# Altium project MagControl.PrjPCB (part 2 of 2)

## Sheet SCH_MagControl_Sheet2.SchDoc
size 431 x 279 mm; Revision: -; SheetNumber: 2; SheetTotal: 2; PageSetup: Record=PageOptions|CenterHorizontal=True|CenterVertical=True|PrintScale=0.98|XCorrection=1.00|YCorrection=1.00|PrintKind=1|BorderSize=5000000|LeftOffset=0|BottomOffset=0|Orientation=2|PaperLength=1000|PaperWidth=1000|Scale=100|PaperSource=15|PrintQuality=600|MediaType=1|DitherType=10|PaperKind=11 x 17|PrintScaleMode=1
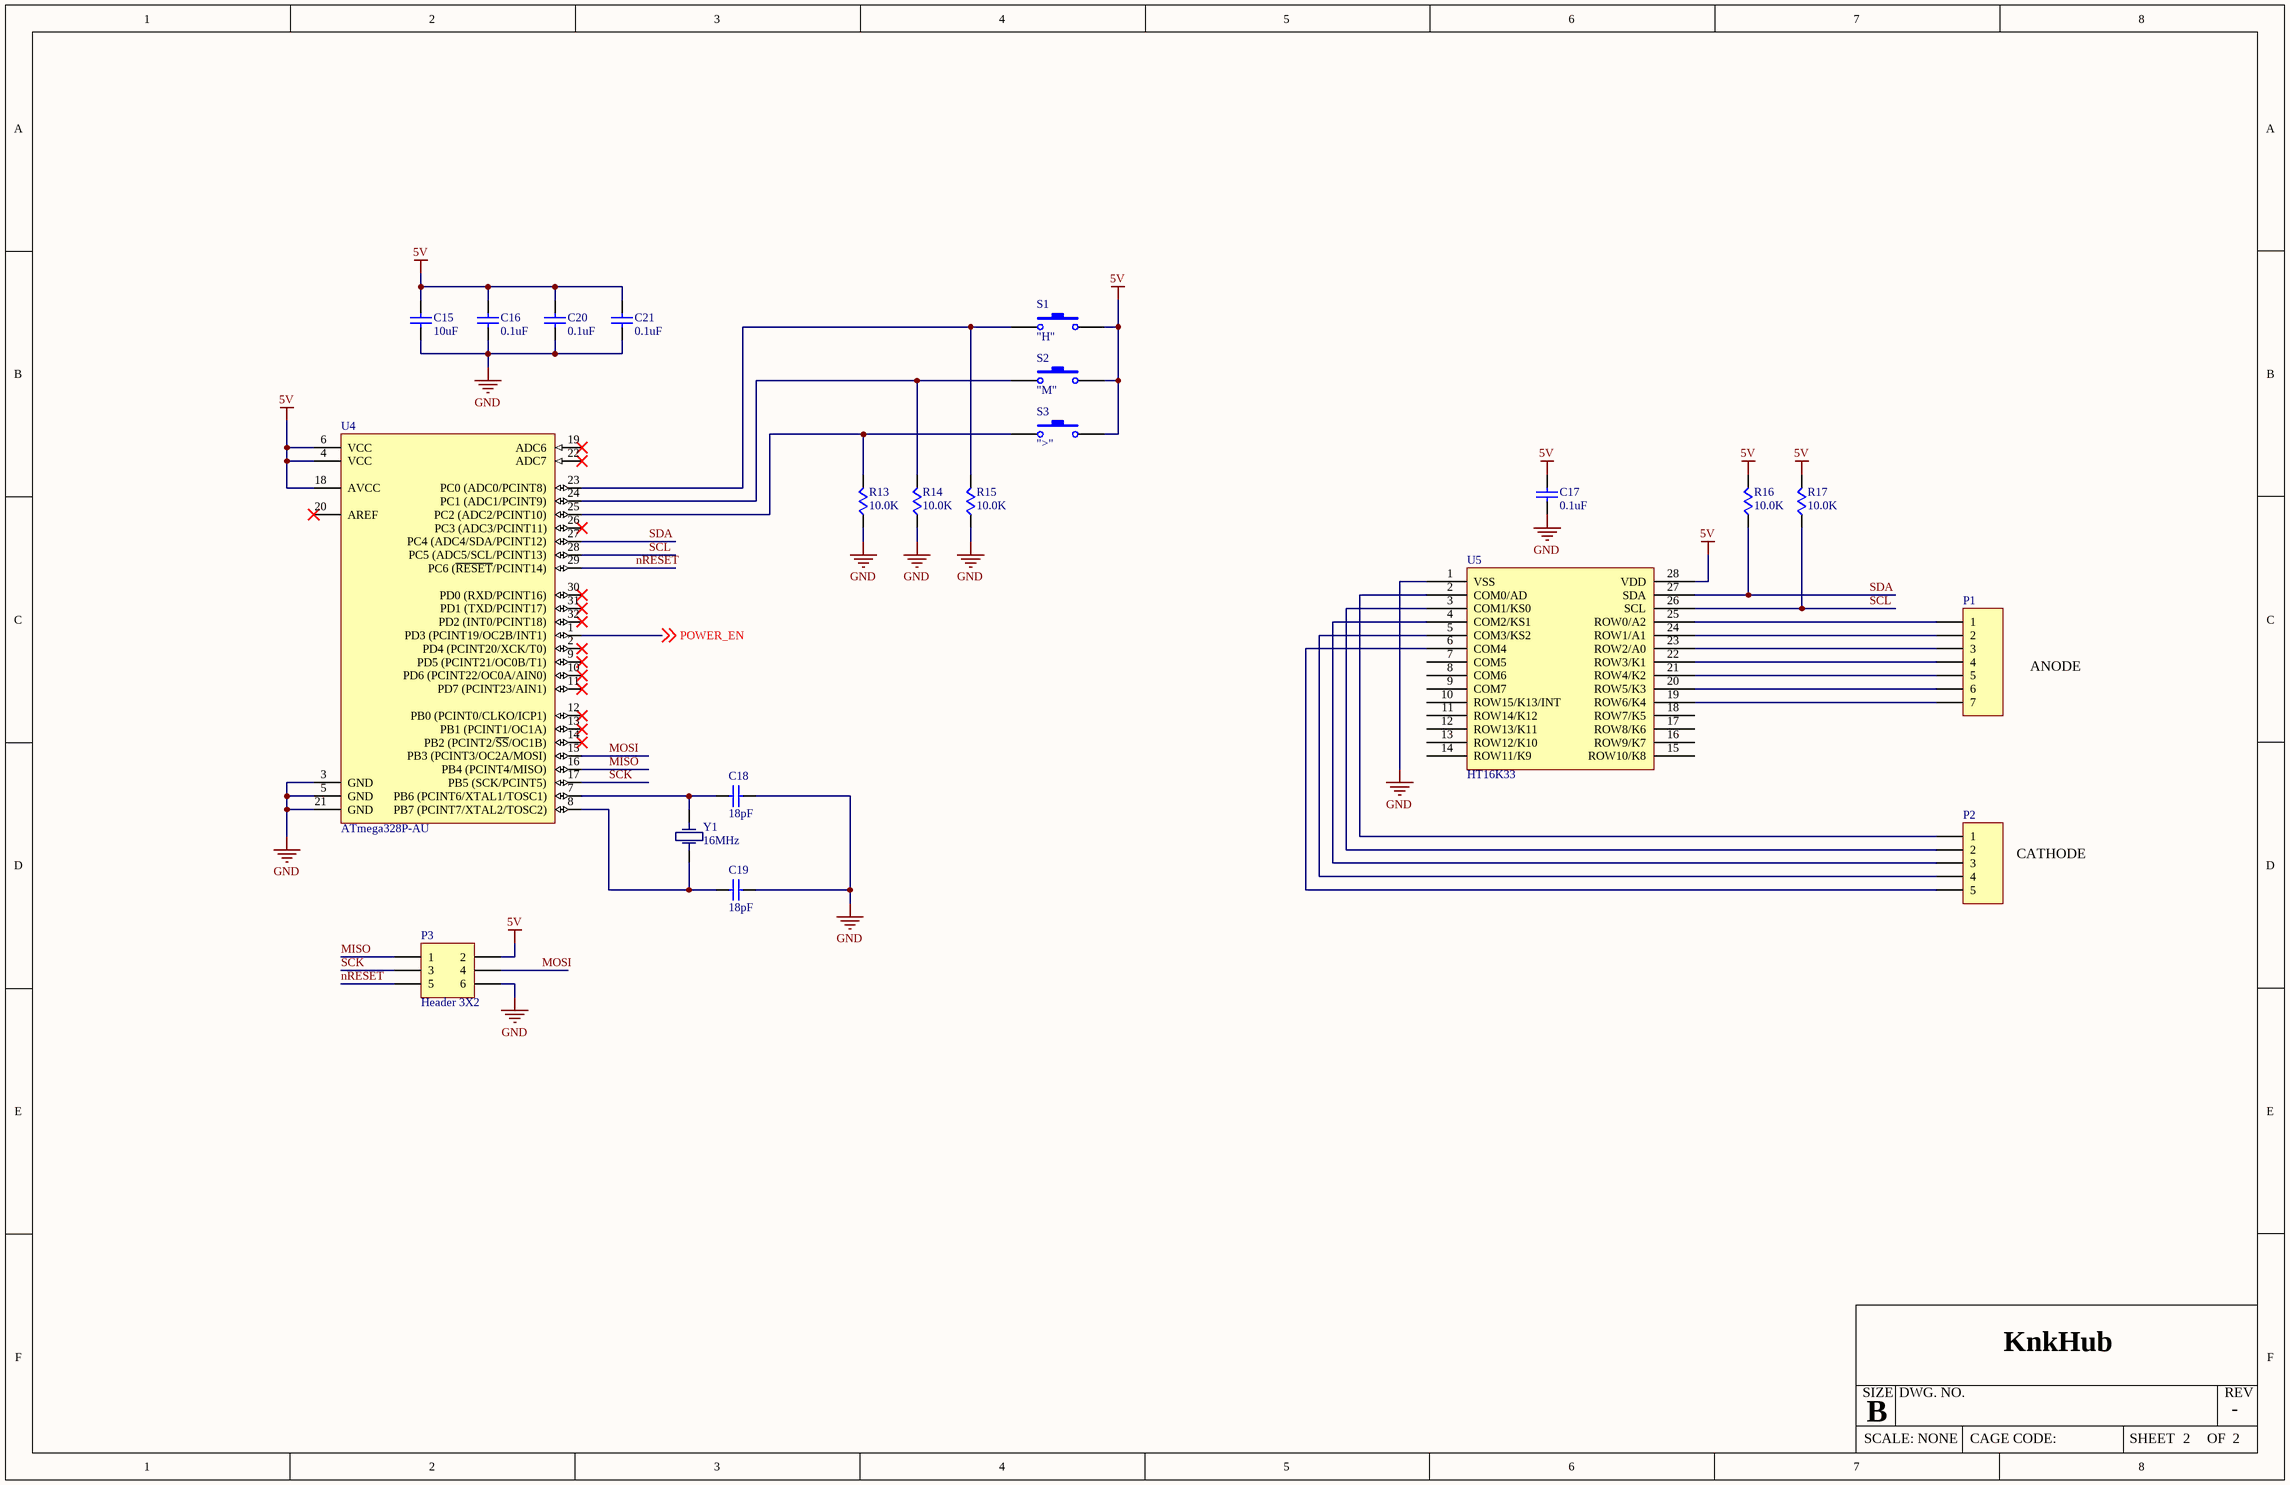
[diagram p1: SCH_MagControl_Sheet2.SchDoc]

### Parts
C15  value 10uF  [CAPC1608L]
C16  value 0.1uF  [CAPC1005L]
C17  value 0.1uF  [CAPC1005L]
C18  value 18pF  [CAPC1005L]
C19  value 18pF  [CAPC1005L]
C20  value 0.1uF  [CAPC1005L]
C21  value 0.1uF  [CAPC1005L]
P1  (no value)  [HDR1X7]
P2  (no value)  [HDR1X5]
P3  value Header 3X2  [HDR2X3]
R13  value 10.0K  [RESC1005N]
R14  value 10.0K  [RESC1005N]
R15  value 10.0K  [RESC1005N]
R16  value 10.0K  [RESC1005N]
R17  value 10.0K  [RESC1005N]
S1  "H"  [SPST-2]
S2  "M"  [SPST-2]
S3  ">"  [SPST-2]
U4  value ATmega328P-AU  [32A_L]
U5  value HT16K33  [SOP127P1030X264-28N]
Y1  value 16MHz  [CSM-3X]

### Nets
5V: C15.2 C16.2 C17.2 C20.2 C21.2 P3.2 R16.2 R17.2 S1.2 S2.2 S3.2 U4.4(VCC) U4.6(VCC) U4.18(AVCC) U5.28(VDD)
GND: C15.1 C16.1 C17.1 C18.1 C19.1 C20.1 C21.1 P3.6 R13.1 R14.1 R15.1 U4.3(GND) U4.5(GND) U4.21(GND) U5.1(VSS)
MISO: P3.1 U4.16(PB4_(PCINT4/MISO))
MOSI: P3.4 U4.15(PB3_(PCINT3/OC2A/MOSI))
nRESET: P3.5 U4.29(PC6_(~{RESET}/PCINT14))
POWER_EN: U4.1(PD3_(PCINT19/OC2B/INT1)) ; off-sheet POWER_EN
SCK: P3.3 U4.17(PB5_(SCK/PCINT5))
SCL: R17.1 U4.28(PC5_(ADC5/SCL/PCINT13)) U5.26(SCL)
SDA: R16.1 U4.27(PC4_(ADC4/SDA/PCINT12)) U5.27(SDA)
NetC18_2: C18.2 U4.7(PB6_(PCINT6/XTAL1/TOSC1)) Y1.1(CI)
NetC19_2: C19.2 U4.8(PB7_(PCINT7/XTAL2/TOSC2)) Y1.2(CO)
NetP1_1: P1.1 U5.25(ROW0/A2)
NetP1_2: P1.2 U5.24(ROW1/A1)
NetP1_3: P1.3 U5.23(ROW2/A0)
NetP1_4: P1.4 U5.22(ROW3/K1)
NetP1_5: P1.5 U5.21(ROW4/K2)
NetP1_6: P1.6 U5.20(ROW5/K3)
NetP1_7: P1.7 U5.19(ROW6/K4)
NetP2_1: P2.1 U5.2(COM0/AD)
NetP2_2: P2.2 U5.3(COM1/KS0)
NetP2_3: P2.3 U5.4(COM2/KS1)
NetP2_4: P2.4 U5.5(COM3/KS2)
NetP2_5: P2.5 U5.6(COM4)
NetR13_2: R13.2 S3.1 U4.25(PC2_(ADC2/PCINT10))
NetR14_2: R14.2 S2.1 U4.24(PC1_(ADC1/PCINT9))
NetR15_2: R15.2 S1.1 U4.23(PC0_(ADC0/PCINT8))

Not connected (* = marked no-connect by the designer): U4 2(PD4_(PCINT20/XCK/T0))* 9(PD5_(PCINT21/OC0B/T1))* 10(PD6_(PCINT22/OC0A/AIN0))* 11(PD7_(PCINT23/AIN1))* 12(PB0_(PCINT0/CLKO/ICP1))* 13(PB1_(PCINT1/OC1A))* 14(PB2_(PCINT2/~{SS}/OC1B))* 19(ADC6)* 20(AREF)* 22(ADC7)* 26(PC3_(ADC3/PCINT11))* 30(PD0_(RXD/PCINT16))* 31(PD1_(TXD/PCINT17))* 32(PD2_(INT0/PCINT18))*; U5 7(COM5) 8(COM6) 9(COM7) 10(ROW15/K13/INT) 11(ROW14/K12) 12(ROW13/K11) 13(ROW12/K10) 14(ROW11/K9) 15(ROW10/K8) 16(ROW9/K7) 17(ROW8/K6) 18(ROW7/K5)

### Notes on the sheet
- ANODE
- CATHODE
- KnkHub
- SIZE
- B
- DWG. NO.
- REV
- SCALE: NONE
- CAGE CODE:
- SHEET
- OF

### Library data of the parts
C15 = Cap Semi: Capacitor (SMD); Manufacturer 1: Samsung; Manufacturer Part Number 1: CL10A106MQ8NNNC; Tolerance: 20%; Voltage Rating: 6.3V; Dielectric: X5R; Supplier 1: Digi-Key; Supplier Part Number 1: 1276-1119-1-ND; Mount: Surface Mount; Case/Package: 0603; Case Code (Metric): 1608; Case Code (Imperial): 0603; Contact Plating: Tin; Min Operating Temperature: -55°C; Max Operating Temperature: 85°C; Capacitance: 10uF; Package Quantity: 1; Packaging: Tape and Reel; Voltage: 6.3V; Length: 1.6mm; Height: 0.8mm; Width: 0.031inch; Thickness: 0.035inch; Depth: 0.8mm; Radiation Hardening: No; ComponentLink1URL: https://datasheet.ciiva.com/25798/cl10a106mq8nnnc-25798320.pdf?src-supplier=Digi-Key; ComponentLink1Description: https://datasheet.ciiva.com/25798/cl10a106mq8nnnc-25798320.pdf?src-supplier=Digi-Key; ComponentLink2URL: https://datasheet.ciiva.com/26838/getdatasheetpartid-357557-26838347.pdf?src-supplier=Verical; ComponentLink2Description: https://datasheet.ciiva.com/26838/getdatasheetpartid-357557-26838347.pdf?src-supplier=Verical; ComponentLink3URL: https://datasheet.ciiva.com/16437/cl05b104kq5nnnc-16437327.pdf?src-supplier=Future+Electronics; ComponentLink3Description: https://datasheet.ciiva.com/16437/cl05b104kq5nnnc-16437327.pdf?src-supplier=Future+Electronics; ComponentLink4URL: http://www.samsungsem.com/kr/support/product-search/mlcc/CL10X106MO8NRNC.jsp?src-supplier=Digi-Key; ComponentLink4Description: http://www.samsungsem.com/kr/support/product-search/mlcc/CL10X106MO8NRNC.jsp?src-supplier=Digi-Key
C16 C17 C20 C21 = Cap Semi: Capacitor (SMD); Manufacturer 1: Samsung; Manufacturer Part Number 1: CL05A104MP5NNNC; Capacitance: 100nF; Tolerance: 20%; Voltage Rating: 10V; Dielectric: X5R; Supplier 1: Digi-Key; Supplier Part Number 1: 1276-1443-1-ND; Mount: Surface Mount; Case/Package: 0402; Case Code (Metric): 1005; Case Code (Imperial): 0402; Min Operating Temperature: -55°C; Max Operating Temperature: 85°C; Packaging: Tape and Reel; Voltage Rating (DC): 10V; Length: 1mm; Height: 0.5mm; Width: 0.02inch; Thickness: 0.022inch; Depth: 0.5mm; Radiation Hardening: No; Lead Free: Lead Free; ComponentLink1URL: https://datasheet.ciiva.com/25709/cl05a104mp5nnnc-25709105.pdf?src-supplier=Digi-Key; ComponentLink1Description: https://datasheet.ciiva.com/25709/cl05a104mp5nnnc-25709105.pdf?src-supplier=Digi-Key
C18 C19 = Cap Semi: Capacitor (SMD); Manufacturer 1: Yageo; Manufacturer Part Number 1: CC0402JRNPO9BN180; Tolerance: 5%; Dielectric: C0G; Voltage Rating: 50V; Temperature Coefficient: 30ppm/°C; Published: 8-Jun-2000; LatestRevisionDate: 29-May-2009; LatestRevisionNote: IPC-7351 Footprint Added.; PackageReference: C1206; Publisher: Altium Limited; PackageDescription: Chip Capacitor; Supplier 1: Digi-Key; Supplier Part Number 1: 311-1415-1-ND; Mount: Surface Mount; Case/Package: 0402; Number of Pins: 2; Weight: 2.3E-05oz; Case Code (Metric): 1005; Case Code (Imperial): 0402; Min Operating Temperature: -55°C; Max Operating Temperature: 125°C; Capacitance: 18pF; Packaging: Tape and Reel; Package Quantity: 1; Voltage Rating (DC): 50V; Termination: SMD/SMT; Composition: Ceramic; Voltage: 50V; Length: 1mm; Height: 0.5mm; Width: 0.02inch; Thickness: 0.022inch; Depth: 0.5mm; Radiation Hardening: No; REACH SVHC: No SVHC; Lead Free: Lead Free; ComponentLink1URL: https://datasheet.ciiva.com/11788/0900766b80d84fbf-11788369.pdf?src-supplier=RSComponents; ComponentLink1Description: https://datasheet.ciiva.com/11788/0900766b80d84fbf-11788369.pdf?src-supplier=RSComponents; ComponentLink2URL: https://datasheet.ciiva.com/176/mlccorderingcode-176357.pdf?src-supplier=Digi-Key; ComponentLink2Description: https://datasheet.ciiva.com/176/mlccorderingcode-176357.pdf?src-supplier=Digi-Key; ComponentLink3URL: https://datasheet.ciiva.com/176/mlccorderingcode-176358.pdf?src-supplier=Digi-Key; ComponentLink3Description: https://datasheet.ciiva.com/176/mlccorderingcode-176358.pdf?src-supplier=Digi-Key; ComponentLink4URL: https://datasheet.ciiva.com/176/mlccorderingcode-176359.pdf?src-supplier=Digi-Key; ComponentLink4Description: https://datasheet.ciiva.com/176/mlccorderingcode-176359.pdf?src-supplier=Digi-Key; ComponentLink5URL: https://datasheet.ciiva.com/28450/1443161-28450232.pdf?src-supplier=Element14; ComponentLink5Description: https://datasheet.ciiva.com/28450/1443161-28450232.pdf?src-supplier=Element14; ComponentLink6URL: https://datasheet.ciiva.com/13208/upy-gp-np0-16v-to-50v-8-13208430.pdf?src-supplier=Mouser; ComponentLink6Description: https://datasheet.ciiva.com/13208/upy-gp-np0-16v-to-50v-8-13208430.pdf?src-supplier=Mouser; ComponentLink7URL: https://datasheet.ciiva.com/11587/upy-gp-np0-16v-to-50v-8-11587087.pdf?src-supplier=Avnet; ComponentLink7Description: https://datasheet.ciiva.com/11587/upy-gp-np0-16v-to-50v-8-11587087.pdf?src-supplier=Avnet
P1 = Header 7: Header, 7-Pin; Manufacturer 1: Wurth Electronics; Manufacturer Part Number 1: 61300711121; Number of Positions: 7; Gender: Male; Connector Type: Male Pin; Pitch: 0.1inch; LatestRevisionDate: 17-Jul-2002; LatestRevisionNote: Re-released for DXP Platform.; Publisher: Altium Limited; Supplier 1: Digi-Key; Supplier Part Number 1: 732-5320-ND; Mount: Through Hole; Contact Plating: Gold; Contact Material: Copper; Color: Black; Number of Rows: 1; Packaging: Bulk; Termination: Solder; Number of Contacts: 7; Contact Mating Length: 0.236inch; REACH SVHC: Unknown; ComponentLink1URL: https://katalog.we-online.de/em/datasheet/6130xx11121.pdf?src-supplier=Digi-Key; ComponentLink1Description: https://katalog.we-online.de/em/datasheet/6130xx11121.pdf?src-supplier=Digi-Key
P2 = Header 5: Header, 5-Pin; Manufacturer 1: Wurth Electronics; Manufacturer Part Number 1: 61300511121; Number of Positions: 5; Gender: Male; Connector Type: Male Pin; Pitch: 0.1inch; LatestRevisionDate: 17-Jul-2002; LatestRevisionNote: Re-released for DXP Platform.; Publisher: Altium Limited; Supplier 1: Digi-Key; Supplier Part Number 1: 732-5318-ND; Mount: Through Hole; Contact Plating: Gold; Contact Material: Copper; Color: Black; Number of Rows: 1; Packaging: Bulk; Termination: Solder; Number of Contacts: 5; Contact Mating Length: 0.236inch; REACH SVHC: Unknown; Lead Free: Lead Free; ComponentLink1URL: https://katalog.we-online.de/em/datasheet/6130xx11121.pdf?src-supplier=Digi-Key; ComponentLink1Description: https://katalog.we-online.de/em/datasheet/6130xx11121.pdf?src-supplier=Digi-Key; ComponentLink2URL: http://www.farnell.com/cad/1737268.pdf?src-supplier=Element14; ComponentLink2Description: http://www.farnell.com/cad/1737268.pdf?src-supplier=Element14
P3 = Header 3X2: Header, 3-Pin, Dual row; Manufacturer 1: Harwin; Manufacturer Part Number 1: M20-9980345; Number of Contacts: 6; Max Current Rating: 3A; Contact Resistance: 25mR; Gender: Male; Insulation Resistance: 10GR; Connector Type: Male Pin; Pitch: 2.54mm; Row Spacing: 0.1inch; LatestRevisionDate: 17-Jul-2002; LatestRevisionNote: Re-released for DXP Platform.; Publisher: Altium Limited; Supplier 1: Digi-Key; Supplier Part Number 1: 952-2120-ND; Mount: Through Hole; Weight: 0.125lb; Contact Plating: Gold; Contact Material: Brass; Color: Black; Housing Color: Black; Housing Material: Nylon; Insulation Material: Polyester; Min Operating Temperature: -40°C; Max Operating Temperature: 105°C; Number of Rows: 2; Termination: Solder; Package Quantity: 1000; Current Rating: 3A; Packaging: Bag; Number of Positions: 6; Orientation: Straight; Length: 7.62mm; Height: 0.125inch; Width: 0.25inch; Contact Mating Length: 0.24inch; Depth: 5.08mm; Radiation Hardening: No; REACH SVHC: No SVHC; ComponentLink1URL: https://datasheet.ciiva.com/6789/91635-6789923.pdf?src-supplier=Newark; ComponentLink1Description: https://datasheet.ciiva.com/6789/91635-6789923.pdf?src-supplier=Newark; ComponentLink2URL: https://datasheet.ciiva.com/11746/0900766b80da602b-11746662.pdf?src-supplier=RSComponents; ComponentLink2Description: https://datasheet.ciiva.com/11746/0900766b80da602b-11746662.pdf?src-supplier=RSComponents; ComponentLink3URL: https://datasheet.ciiva.com/26852/getdatasheetpartid-420465-26852189.pdf?src-supplier=Verical; ComponentLink3Description: https://datasheet.ciiva.com/26852/getdatasheetpartid-420465-26852189.pdf?src-supplier=Verical; ComponentLink4URL: https://datasheet.ciiva.com/6830/m20-998-6830775.pdf?src-supplier=Digi-Key; ComponentLink4Description: https://datasheet.ciiva.com/6830/m20-998-6830775.pdf?src-supplier=Digi-Key; ComponentLink5URL: https://datasheet.ciiva.com/8046/112195-8046904.pdf?src-supplier=Element14; ComponentLink5Description: https://datasheet.ciiva.com/8046/112195-8046904.pdf?src-supplier=Element14
R13-R17 = R: RES 10.0K OHM 1/10W 1% 0402 SMD; Manufacturer 1: Panasonic; Manufacturer Part Number 1: ERJ-2RKF1002X; Resistance: 10kR; Temperature Coefficient: 100ppm/°C; Power Rating: 100mW; Voltage Rating: 50V; Supplier 1: Digi-Key; Supplier Part Number 1: P10.0KLCT-ND; Mount: Surface Mount; Case/Package: 0402; Number of Pins: 2; Contact Plating: Tin; Case Code (Metric): 1005; Case Code (Imperial): 0402; Min Operating Temperature: -55°C; Max Operating Temperature: 155°C; Tolerance: 1%; Composition: Thick Film; Packaging: Tape and Reel; Package Quantity: 1; Number of Terminations: 2; Termination: SMD/SMT; Military Standard: Not; Max Power Dissipation: 100mW; Voltage Rating (DC): 50V; Features: Automotive AEC-Q200; Length: 1mm; Height: 0.35mm; Width: 0.02inch; Depth: 0.5mm; Radiation Hardening: No; REACH SVHC: No SVHC; Lead Free: Lead Free; ComponentLink1URL: https://datasheet.ciiva.com/11821/0900766b80f80784-11821171.pdf?src-supplier=RSComponents; ComponentLink1Description: https://datasheet.ciiva.com/11821/0900766b80f80784-11821171.pdf?src-supplier=RSComponents; ComponentLink2URL: https://datasheet.ciiva.com/17212/aoa0000ce2-17212102.pdf?src-supplier=Avnet+Europe; ComponentLink2Description: https://datasheet.ciiva.com/17212/aoa0000ce2-17212102.pdf?src-supplier=Avnet+Europe; ComponentLink3URL: https://datasheet.ciiva.com/28514/1678782-28514185.pdf?src-supplier=Element14; ComponentLink3Description: https://datasheet.ciiva.com/28514/1678782-28514185.pdf?src-supplier=Element14; ComponentLink4URL: https://datasheet.ciiva.com/43467/1678782-43467402.pdf?src-supplier=Farnell; ComponentLink4Description: https://datasheet.ciiva.com/43467/1678782-43467402.pdf?src-supplier=Farnell; ComponentLink5URL: https://datasheet.ciiva.com/27055/1987020-27055643.pdf?src-supplier=Jameco; ComponentLink5Description: https://datasheet.ciiva.com/27055/1987020-27055643.pdf?src-supplier=Jameco; ComponentLink6URL: https://datasheet.ciiva.com/48531/aoa0000ce2-48531069.pdf?src-supplier=Avnet; ComponentLink6Description: https://datasheet.ciiva.com/48531/aoa0000ce2-48531069.pdf?src-supplier=Avnet; ComponentLink7URL: https://datasheet.ciiva.com/30201/aoa0000ce2-30201022.pdf?src-supplier=Onlinecomponents.com; ComponentLink7Description: https://datasheet.ciiva.com/30201/aoa0000ce2-30201022.pdf?src-supplier=Onlinecomponents.com; ComponentLink8URL: https://datasheet.ciiva.com/16199/aoa0000ce2-16199478.pdf?src-supplier=Future+Electronics; ComponentLink8Description: https://datasheet.ciiva.com/16199/aoa0000ce2-16199478.pdf?src-supplier=Future+Electronics; ComponentLink9URL: https://datasheet.ciiva.com/24023/aoa0000ce2-24023017.pdf?src-supplier=Mouser; ComponentLink9Description: https://datasheet.ciiva.com/24023/aoa0000ce2-24023017.pdf?src-supplier=Mouser; ComponentLink10URL: https://datasheet.ciiva.com/9194/aoa0000ce2-9194142.pdf?src-supplier=Avnet; ComponentLink10Description: https://datasheet.ciiva.com/9194/aoa0000ce2-9194142.pdf?src-supplier=Avnet; ComponentLink11URL: https://datasheet.ciiva.com/16782/70260748-16782590.pdf?src-supplier=Allied+Electronics; ComponentLink11Description: https://datasheet.ciiva.com/16782/70260748-16782590.pdf?src-supplier=Allied+Electronics; ComponentLink12URL: https://datasheet.ciiva.com/16786/70260748-16786734.pdf?src-supplier=Allied+Electronics; ComponentLink12Description: https://datasheet.ciiva.com/16786/70260748-16786734.pdf?src-supplier=Allied+Electronics
S1-S3 = SW-PB: Switch; Published: 24-Mar-1999; LatestRevisionDate: 17-Jul-2002; LatestRevisionNote: Re-released for DXP Platform.; PackageReference: SPST-2; Publisher: Altium Limited; PackageDescription: Switch; 2 Leads
U4 = CMP-0095-00269-2: 8-bit AVR Microcontroller, 32KB Flash, 1KB EEPROM, 2KB SRAM, 32-pin TQFP, Industrial Grade (-40°C to 85°C); Manufacturer 1: Microchip / Atmel; Frequency: 20MHz; Interface: I2C; Number of I/Os: 23; Oscillator Type: Internal; Peripherals: Brown-out Detect/Reset; Max Supply Voltage: 5.5V; Min Supply Voltage: 1.8V; Number of Timers/Counters: 3; Data Bus Width: 8b; Watchdog Timer: Yes; Number of ADC Channels: 8; Number of PWM Channels: 6; Number of SPI Channels: 1; PackageDescription: 32-Lead, 7x7x1.0 mm Body, 0.8mm Lead Pitch, Thin Profile Plastic Quad Flat Package (TQFP); DatasheetVersion: revD, May-2011; RevisionNote: DatasheetVersion & PackageVersion updated. URLs added.; ComponentLink1URL: http://www.atmel.com/; ComponentLink2Description: ATmega48A/48PA/88A/88PA/168A/168PA/328/328P Datasheet; Code_JEDEC: MS-026-ABA; ComponentLink1Description: Manufacturer URL; PackageReference: 32A; ComponentLink3Description: ATmega48A/48PA/88A/88PA/168A/168PA/328/328P Summary; ComponentLink2URL: http://www.atmel.com/dyn/resources/prod_documents/doc8271.pdf; PackageVersion: revC, Oct-2010; ComponentLink3URL: http://www.atmel.com/dyn/resources/prod_documents/8271S.pdf; Supplier 1: Digi-Key; Supplier Part Number 1: ATMEGA328P-AU-ND; Manufacturer Part Number 1: ATMEGA328P-AU; Mount: Surface Mount; Case/Package: A; Number of Pins: 32; Min Operating Temperature: -40°C; Max Operating Temperature: 85°C; Packaging: Tray; Memory Type: FLASH; Memory Size: 32KB; Core Architecture: AVR; Package Quantity: 250; RAM Size: 2KB; Number of Programmable I/O: 23; Max Frequency: 20MHz; Number of I2C Channels: 1; Length: 7mm; Height: 1.05mm; Width: 7mm; Radiation Hardening: No; REACH SVHC: No SVHC; Lead Free: Lead Free; ComponentLink4URL: https://datasheet.ciiva.com/1166/doc8161-1166860.pdf?src-supplier=Newark; ComponentLink4Description: https://datasheet.ciiva.com/1166/doc8161-1166860.pdf?src-supplier=Newark; ComponentLink5URL: https://datasheet.ciiva.com/29119/155196-da-01-en-microcontr-atmega328p-au-8bit-tqfp-32-29119594.pdf?src-supplier=Conrad; ComponentLink5Description: https://datasheet.ciiva.com/29119/155196-da-01-en-microcontr-atmega328p-au-8bit-tqfp-32-29119594.pdf?src-supplier=Conrad; ComponentLink6URL: https://datasheet.ciiva.com/15213/getdatasheetpartid-365828-15213131.pdf?src-supplier=Verical; ComponentLink6Description: https://datasheet.ciiva.com/15213/getdatasheetpartid-365828-15213131.pdf?src-supplier=Verical; ComponentLink7URL: https://datasheet.ciiva.com/1157/1693866-1157693.pdf?src-supplier=Element14; ComponentLink7Description: https://datasheet.ciiva.com/1157/1693866-1157693.pdf?src-supplier=Element14
U5 = HT16K33_28: LED Matrix Driver
Y1 = CRYSTAL: Manufacturer 1: ECS International; Manufacturer Part Number 1: ECS-160-20-3X-EN-TR; Frequency Tolerance: 30ppm; Load Capacitance: 20pF; ESR (Equivalent Series Resistance): 50R; Frequency Stability: 50ppm; Supplier 1: Digi-Key; Supplier Part Number 1: XC1793CT-ND; Mount: Surface Mount; Min Operating Temperature: -40°C; Max Operating Temperature: 85°C; Package Quantity: 1; Frequency: 16MHz; Packaging: Tape and Reel; Tolerance: 30ppm; Termination: SMD/SMT; Length: 0.276inch; Height: 0.091inch; Width: 0.161inch; Lead Free: Lead Free; ComponentLink1URL: https://datasheet.ciiva.com/852/csm-3x-852506.pdf?src-supplier=Digi-Key; ComponentLink1Description: https://datasheet.ciiva.com/852/csm-3x-852506.pdf?src-supplier=Digi-Key; ComponentLink2URL: https://datasheet.ciiva.com/852/csm-3x-852507.pdf?src-supplier=Digi-Key; ComponentLink2Description: https://datasheet.ciiva.com/852/csm-3x-852507.pdf?src-supplier=Digi-Key; ComponentLink3URL: https://datasheet.ciiva.com/852/csm-3x-852508.pdf?src-supplier=Digi-Key; ComponentLink3Description: https://datasheet.ciiva.com/852/csm-3x-852508.pdf?src-supplier=Digi-Key

## Nets that join several sheets
5V: SCH_MagControl_Sheet1 (7 pins), SCH_MagControl_Sheet2 (15 pins)
GND: SCH_MagControl_Sheet1 (56 pins), SCH_MagControl_Sheet2 (15 pins)
POWER_EN: SCH_MagControl_Sheet1 (R3.1), SCH_MagControl_Sheet2 (U4.1)